# Altium schematic sheet Clock_fanout.SchDoc: =SheetTitle_Top
size 420 x 297 mm; Author: G.Kasprowicz; CompanyName: WUT ISE; DrawnBy: G.Kasprowicz; Organization: WUT ISE; Address1: PW ISE; Address2: Nowowiejska 15/19 00-665 Warsaw; Address3: gkasprow@gmail.com; ModifiedBy: -; CheckedDate: -; Title2: Clock Fanout; DivGrp: WUT ISE; Designer: G.Kasprowicz; ModifiedDate: -; ProjectName: Sensor Box
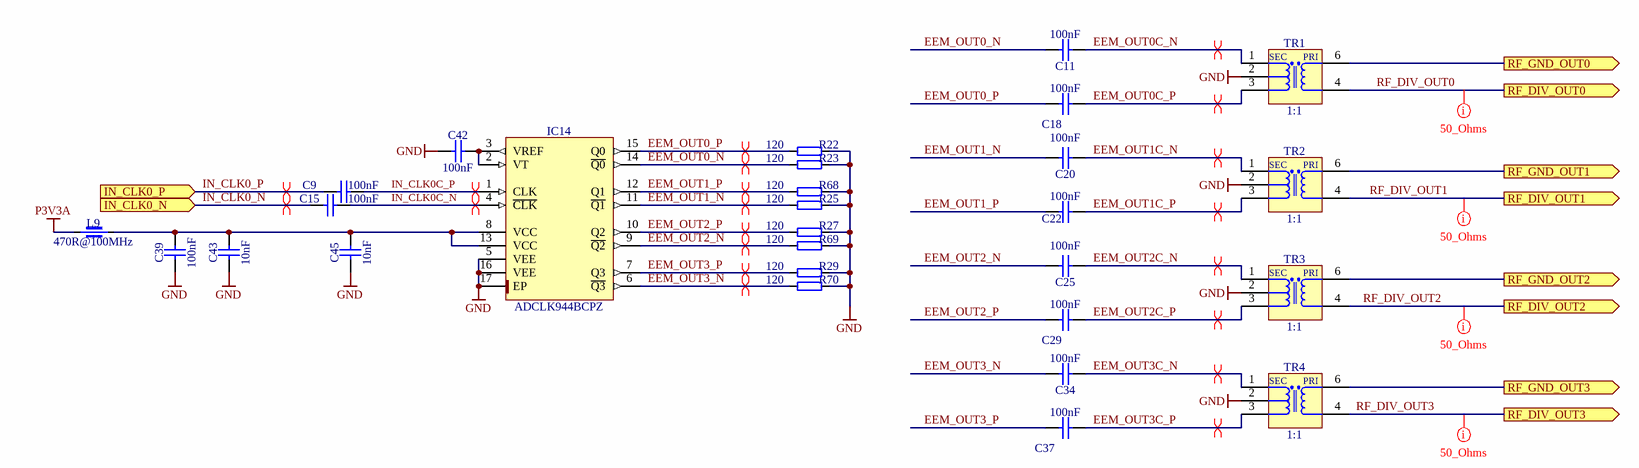
[diagram p0: Clock_fanout.SchDoc]

## Parts
C9  100nF  [CAPC1005X55N]
C11  100nF  [CAPC1005X55N]
C15  100nF  [CAPC1005X55N]
C18  100nF  [CAPC1005X55N]
C20  100nF  [CAPC1005X55N]
C22  100nF  [CAPC1005X55N]
C25  100nF  [CAPC1005X55N]
C29  100nF  [CAPC1005X55N]
C34  100nF  [CAPC1005X55N]
C37  100nF  [CAPC1005X55N]
C39  100nF  [CAPC1005X55N]
C42  100nF  [CAPC1005X55N]
C43  10nF  [CAPC1005X55N]
C45  10nF  [CAPC1005X55N]
IC14  ADCLK944BCPZ  [QFN50P300X300X80-17N-S160]
L9  470R@100MHz  [INDC1608X95N]
R22  120  [RESC1005X40N]
R23  120  [RESC1005X40N]
R25  120  [RESC1005X40N]
R27  120  [RESC1005X40N]
R29  120  [RESC1005X40N]
R68  120  [RESC1005X40N]
R69  120  [RESC1005X40N]
R70  120  [RESC1005X40N]
TR1  1:1  [XFMR_MINI-CIRCUITS_AT1521]
TR2  1:1  [XFMR_MINI-CIRCUITS_AT1521]
TR3  1:1  [XFMR_MINI-CIRCUITS_AT1521]
TR4  1:1  [XFMR_MINI-CIRCUITS_AT1521]

## Ports
IN_CLK0_N (in), IN_CLK0_P (in), RF_DIV_OUT0 (out), RF_DIV_OUT1 (out), RF_DIV_OUT2 (out), RF_DIV_OUT3 (out), RF_GND_OUT0 (out), RF_GND_OUT1 (out), RF_GND_OUT2 (out), RF_GND_OUT3 (out)

## Nets
GND: C39.1 C42.1 C43.1 C45.1 IC14.5(VEE) IC14.16(VEE) IC14.17(EP) R22.2 R23.2 R25.2 R27.2 R29.2 R68.2 R69.2 R70.2 TR1.2(NC) TR2.2(NC) TR3.2(NC) TR4.2(NC)
P3V3A: L9.1
EEM_OUT0_N: C11.2 IC14.14(~{Q0}) R23.1
EEM_OUT0_P: C18.2 IC14.15(Q0) R22.1
EEM_OUT0C_N: C11.1 TR1.1(SDOT)
EEM_OUT0C_P: C18.1 TR1.3(S)
EEM_OUT1_N: C20.2 IC14.11(~{Q1}) R25.1
EEM_OUT1_P: C22.2 IC14.12(Q1) R68.1
EEM_OUT1C_N: C20.1 TR2.1(SDOT)
EEM_OUT1C_P: C22.1 TR2.3(S)
EEM_OUT2_N: C25.2 IC14.9(~{Q2}) R69.1
EEM_OUT2_P: C29.2 IC14.10(Q2) R27.1
EEM_OUT2C_N: C25.1 TR3.1(SDOT)
EEM_OUT2C_P: C29.1 TR3.3(S)
EEM_OUT3_N: C34.2 IC14.6(~{Q3}) R70.1
EEM_OUT3_P: C37.2 IC14.7(Q3) R29.1
EEM_OUT3C_N: C34.1 TR4.1(SDOT)
EEM_OUT3C_P: C37.1 TR4.3(S)
IN_CLK0_N: C15.1 ; port IN_CLK0_N
IN_CLK0_P: C9.1 ; port IN_CLK0_P
IN_CLK0C_N: C15.2 IC14.4(~{CLK})
IN_CLK0C_P: C9.2 IC14.1(CLK)
RF_DIV_OUT0: TR1.4(P) ; port RF_DIV_OUT0
RF_DIV_OUT1: TR2.4(P) ; port RF_DIV_OUT1
RF_DIV_OUT2: TR3.4(P) ; port RF_DIV_OUT2
RF_DIV_OUT3: TR4.4(P) ; port RF_DIV_OUT3
RF_GND_OUT0: TR1.6(PDOT) ; port RF_GND_OUT0
RF_GND_OUT1: TR2.6(PDOT) ; port RF_GND_OUT1
RF_GND_OUT2: TR3.6(PDOT) ; port RF_GND_OUT2
RF_GND_OUT3: TR4.6(PDOT) ; port RF_GND_OUT3
NetC39_2: C39.2 C43.2 C45.2 IC14.8(VCC) IC14.13(VCC) L9.2
NetC42_2: C42.2 IC14.2(VT) IC14.3(VREF)

## Layout directives
differential pair: EEM_OUT0_N, EEM_OUT0_P, EEM_OUT0C_N, EEM_OUT0C_P, EEM_OUT1_N, EEM_OUT1_P, EEM_OUT1C_N, EEM_OUT1C_P, EEM_OUT2_N, EEM_OUT2_P, EEM_OUT2C_N, EEM_OUT2C_P, EEM_OUT3_N, EEM_OUT3_P, EEM_OUT3C_N, EEM_OUT3C_P, IN_CLK0_N, IN_CLK0_P, IN_CLK0C_N, IN_CLK0C_P
net class 50_Ohms: RF_DIV_OUT0, RF_DIV_OUT1, RF_DIV_OUT2, RF_DIV_OUT3

## Notes on the sheet
- Project/Equipment
- Document
- Designer
- Drawn by
- Check.by
- Copyright WUT ISE 2020.
  This documentation describes Open Hardware and is licensed under the CERN OHL v.1.2. You may redistribute and modify this documentation under the terms of the CERN OHL v.1.2. (http://ohwr.org/CERNOHL). This documentation is distributed WITHOUT ANY EXPRESS OR IMPLIED WARRANTY, INCLUDING OF MERCHANTABILITY, SATISFACTORY QUALITY AND FITNESS FOR A PARTICULAR PURPOSE. Please see the CERN OHL v.1.2 for applicable conditions.
- Contact
- File
- Last Mod.
- Print Date
- Sheet
- Size
- A3
- of
- Rev
- (in symbol XFMR_MINI-CIRCUITS_TC2-1TX+) SEC; PRI

## Library data of the parts
C9 C11 C15 C18 C20 C22 C25 C29 C34 C37 C39 C42 = CC0402_100NF_16V_10%_X5R: Non-polarised capacitor; Part Description: SMD Multilayer Chip Ceramic Capacitor; Manufacturer: GENERIC; Manufacturer1 Part Number: GRM155R61C104KA88D; Voltage: 16V; TC: X5R; Tolerance: ±10%; Part Number: CC0402_100NF_16V_10%_X5R; Component Kind: Standard; Component Type: Standard; Pin Count: 2; Value: 100nF; Status: None; Manufacturer Part Number: CC0402_100NF_16V_10%_X5R; Case: 0402; Mounted: Yes; Socket: No; SMD: Yes; Sense: No; Manufacturer1 Example: MURATA; Manufacturer1 ComponentHeight: 0.55mm; HelpURL: \\cern.ch\dfs\Applications\Altium\Datasheets\CC0402_X5R_MURATA_GRM.pdf; Author: CERN DEM JLC; CreateDate: 10.12.2013; LatestRevisionDate: 10.12.2013
C43 C45 = CC0402_10NF_16V_10%_X7R: Non-polarised capacitor; Part Description: SMD Multilayer Chip Ceramic Capacitor; Manufacturer: GENERIC; Manufacturer1 Part Number: 223878715636; Voltage: 16V; TC: X7R; Tolerance: ±10%; Part Number: CC0402_10NF_16V_10%_X7R; Component Kind: Standard; Component Type: Standard; Pin Count: 2; Value: 10nF; Status: Not Recommended; Manufacturer Part Number: CC0402_10NF_16V_10%_X7R; Case: 0402; Mounted: Yes; Socket: No; SMD: Yes; Sense: No; Manufacturer1 Example: PHYCOMP; Manufacturer1 ComponentHeight: 0.55mm; HelpURL: \\cern.ch\dfs\Applications\Altium\Datasheets\CC0402_X7R_PHYCOMP.pdf; Author: CERN DEM JLC; CreateDate: 03.12.2007; LatestRevisionDate: 03.12.2007
IC14 = ADCLK944BCPZ: 2.5V/3.3V, Four LVPECL Outputs, SiGe Clock Fanout Buffer; Manufacturer: ANALOG DEVICES; PressFit: No; Bonding: No; Part Number: ADCLK944BCPZ; Component Kind: Standard; Component Type: Standard; Device: ADCLK944BCPZ; PackageDescription: QFN, 0.50mm Pitch, Square; 16 Pin, 3.00mm L X 3.00mm W X 0.80mm H body (w/Thermal Tab 1.60 X 1.60mm), IPC Medium Density; Part Description: 2.5V/3.3V, Four LVPECL Outputs, SiGe Clock Fanout Buffer; Manufacturer Part Number: ADCLK944BCP; Pin Count: 17; Case: QFN16; Mounted: Yes; Socket: No; SMD: Yes; Sense: No; ComponentHeight: 0.8mm; Author: CERN DEM JLC; HelpURL: \\cern.ch\dfs\Applications\Altium\Datasheets\ADCLK944BCPZ.pdf; CreateDate: 17.07.2014; LatestRevisionDate: 25.03.2022
L9 = IND0603_MURATA_BLM18PG471SN1D: Part Description: SMD EMIFIL Chip Ferrite Bead; Manufacturer: MURATA; Power: 1A; Resistance: 0.2R; Tolerance: ±25%; Part Number: IND0603_MURATA_BLM18PG471SN1D; Component Kind: Standard; Component Type: Standard; Pin Count: 2; Value: 470R@100MHz; Manufacturer Part Number: BLM18PG471SN1D; Case: 0603; Mounted: Yes; Socket: No; SMD: Yes; Sense: No; ComponentHeight: 0.95mm; HelpURL: \\cern.ch\dfs\Applications\Altium\Datasheets\IND0603_MURATA_BLM18P.pdf; Author: CERN DEM BC; CreateDate: 17.02.2021; LatestRevisionDate: 17.02.2021
R22 R23 R25 R27 R29 R68-R70 = R0402_120R_1%_0.0625W_100PPM: Resistor - 1%; Part Description: General Purpose Thick Film Chip Resistor; Manufacturer: GENERIC; Manufacturer1 Part Number: 232270671201L; TC: ±100ppm/°C; PressFit: No; Part Number: R0402_120R_1%_0.0625W_100PPM; Component Kind: Standard; Component Type: Standard; Pin Count: 2; Value: 120; Status: Not Recommended; Power: 0.0625W; Tolerance: ±1%; Manufacturer Part Number: R0402_120R_1%_0.0625W_100PPM; Case: 0402; Mounted: Yes; Sense: No; Socket: No; SMD: Yes; Manufacturer1 Example: YAGEO PHYCOMP; Manufacturer1 ComponentHeight: 0.4mm; HelpURL: \\cern.ch\dfs\Applications\Altium\Datasheets\R0402_Phycomp_RC0402.pdf; Author: CERN DEM JLC; CreateDate: 03.12.2007; LatestRevisionDate: 17.10.2012
TR1-TR4 = XFMR_MINI-CIRCUITS_TC2-1TX+: 50 Ohms 3 to 300MHz RF Transformer; Part Number: XFMR_MINI-CIRCUITS_TC2-1TX+; Component Kind: Standard; Component Type: Standard; Pin Count: 5; Value: 1:1; Status: None; Part Description: 50 Ohms 3 to 300MHz RF Transformer; Manufacturer: MINI-CIRCUITS; Manufacturer Part Number: TC2-1TX+; Mounted: Yes; Socket: No; Sense: No; SMD: Yes; ComponentHeight: 4.06mm; HelpURL: \\cern.ch\dfs\Applications\Altium\Datasheets\XFMR_MINI-CIRCUITS_TC2-1TX+.pdf; Author: CERN DEM MR; CreateDate: 18.10.2019; LatestRevisionDate: 18.10.2019